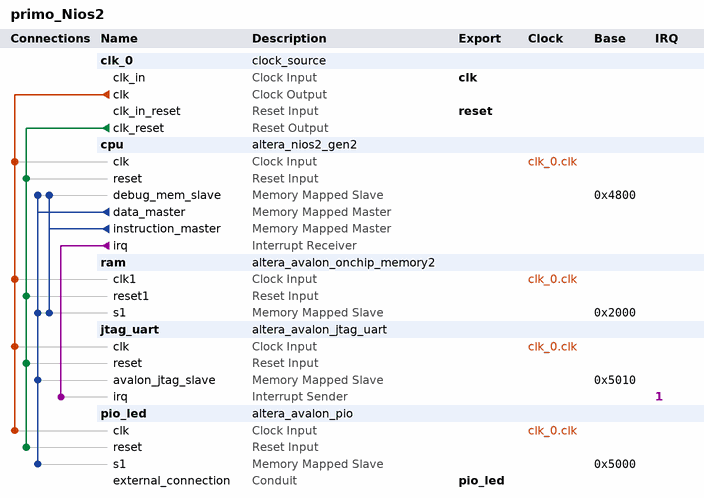
[diagram p0: system contents]
# Platform Designer (Qsys) system primo_Nios2, Cyclone IV E EP4CE6E22C8
# Parameters at their usual value, and those the tool derives, are not listed.
package require -exact qsys 18.1
create_system primo_Nios2
set_project_property DEVICE_FAMILY {Cyclone IV E}
set_project_property DEVICE EP4CE6E22C8

add_instance clk_0 clock_source 18.1
set_instance_parameter_value clk_0 clockFrequency 50000000

add_instance cpu altera_nios2_gen2 18.1
set_instance_parameter_value cpu dcache_size 2048
set_instance_parameter_value cpu exceptionSlave ram.s1
set_instance_parameter_value cpu icache_size 4096
set_instance_parameter_value cpu impl Fast
set_instance_parameter_value cpu resetSlave ram.s1

add_instance ram altera_avalon_onchip_memory2 18.1
set_instance_parameter_value ram dataWidth 32
set_instance_parameter_value ram dualPort false
set_instance_parameter_value ram initMemContent true
set_instance_parameter_value ram initializationFileName onchip_mem.hex
set_instance_parameter_value ram memorySize 8192

add_instance jtag_uart altera_avalon_jtag_uart 18.1
set_instance_parameter_value jtag_uart simInteractiveOptions NO_INTERACTIVE_WINDOWS

add_instance pio_led altera_avalon_pio 18.1
set_instance_parameter_value pio_led direction Output
set_instance_parameter_value pio_led width 8

# connections
add_connection clk_0.clk cpu.clk clock
add_connection clk_0.clk jtag_uart.clk clock
add_connection clk_0.clk pio_led.clk clock
add_connection clk_0.clk ram.clk1 clock
add_connection clk_0.clk_reset cpu.reset reset
add_connection clk_0.clk_reset jtag_uart.reset reset
add_connection clk_0.clk_reset pio_led.reset reset
add_connection clk_0.clk_reset ram.reset1 reset
add_connection cpu.data_master cpu.debug_mem_slave avalon
set_connection_parameter_value cpu.data_master/cpu.debug_mem_slave baseAddress 0x4800
add_connection cpu.data_master jtag_uart.avalon_jtag_slave avalon
set_connection_parameter_value cpu.data_master/jtag_uart.avalon_jtag_slave baseAddress 0x5010
add_connection cpu.data_master pio_led.s1 avalon
set_connection_parameter_value cpu.data_master/pio_led.s1 baseAddress 0x5000
add_connection cpu.data_master ram.s1 avalon
set_connection_parameter_value cpu.data_master/ram.s1 baseAddress 0x2000
add_connection cpu.instruction_master cpu.debug_mem_slave avalon
set_connection_parameter_value cpu.instruction_master/cpu.debug_mem_slave baseAddress 0x4800
add_connection cpu.instruction_master ram.s1 avalon
set_connection_parameter_value cpu.instruction_master/ram.s1 baseAddress 0x2000
add_connection cpu.irq jtag_uart.irq interrupt
set_connection_parameter_value cpu.irq/jtag_uart.irq irqNumber 1

# exported interfaces
add_interface clk clock sink
set_interface_property clk EXPORT_OF clk_0.clk_in
add_interface pio_led conduit end
set_interface_property pio_led EXPORT_OF pio_led.external_connection
add_interface reset reset sink
set_interface_property reset EXPORT_OF clk_0.clk_in_reset

set_interconnect_requirement {$system} qsys_mm.clockCrossingAdapter HANDSHAKE
set_interconnect_requirement {$system} qsys_mm.enableEccProtection FALSE
set_interconnect_requirement {$system} qsys_mm.insertDefaultSlave FALSE
set_interconnect_requirement {$system} qsys_mm.maxAdditionalLatency 1

save_system primo_Nios2.qsys
